# EasyEDA schematic SCH_Tremolo schematic_2023-01-16.json
TITLE: Tremolo; REV: 1.0; Date: 2022-03-30; Sheet: 1/1; Drawn By: Leevi & Eemeli
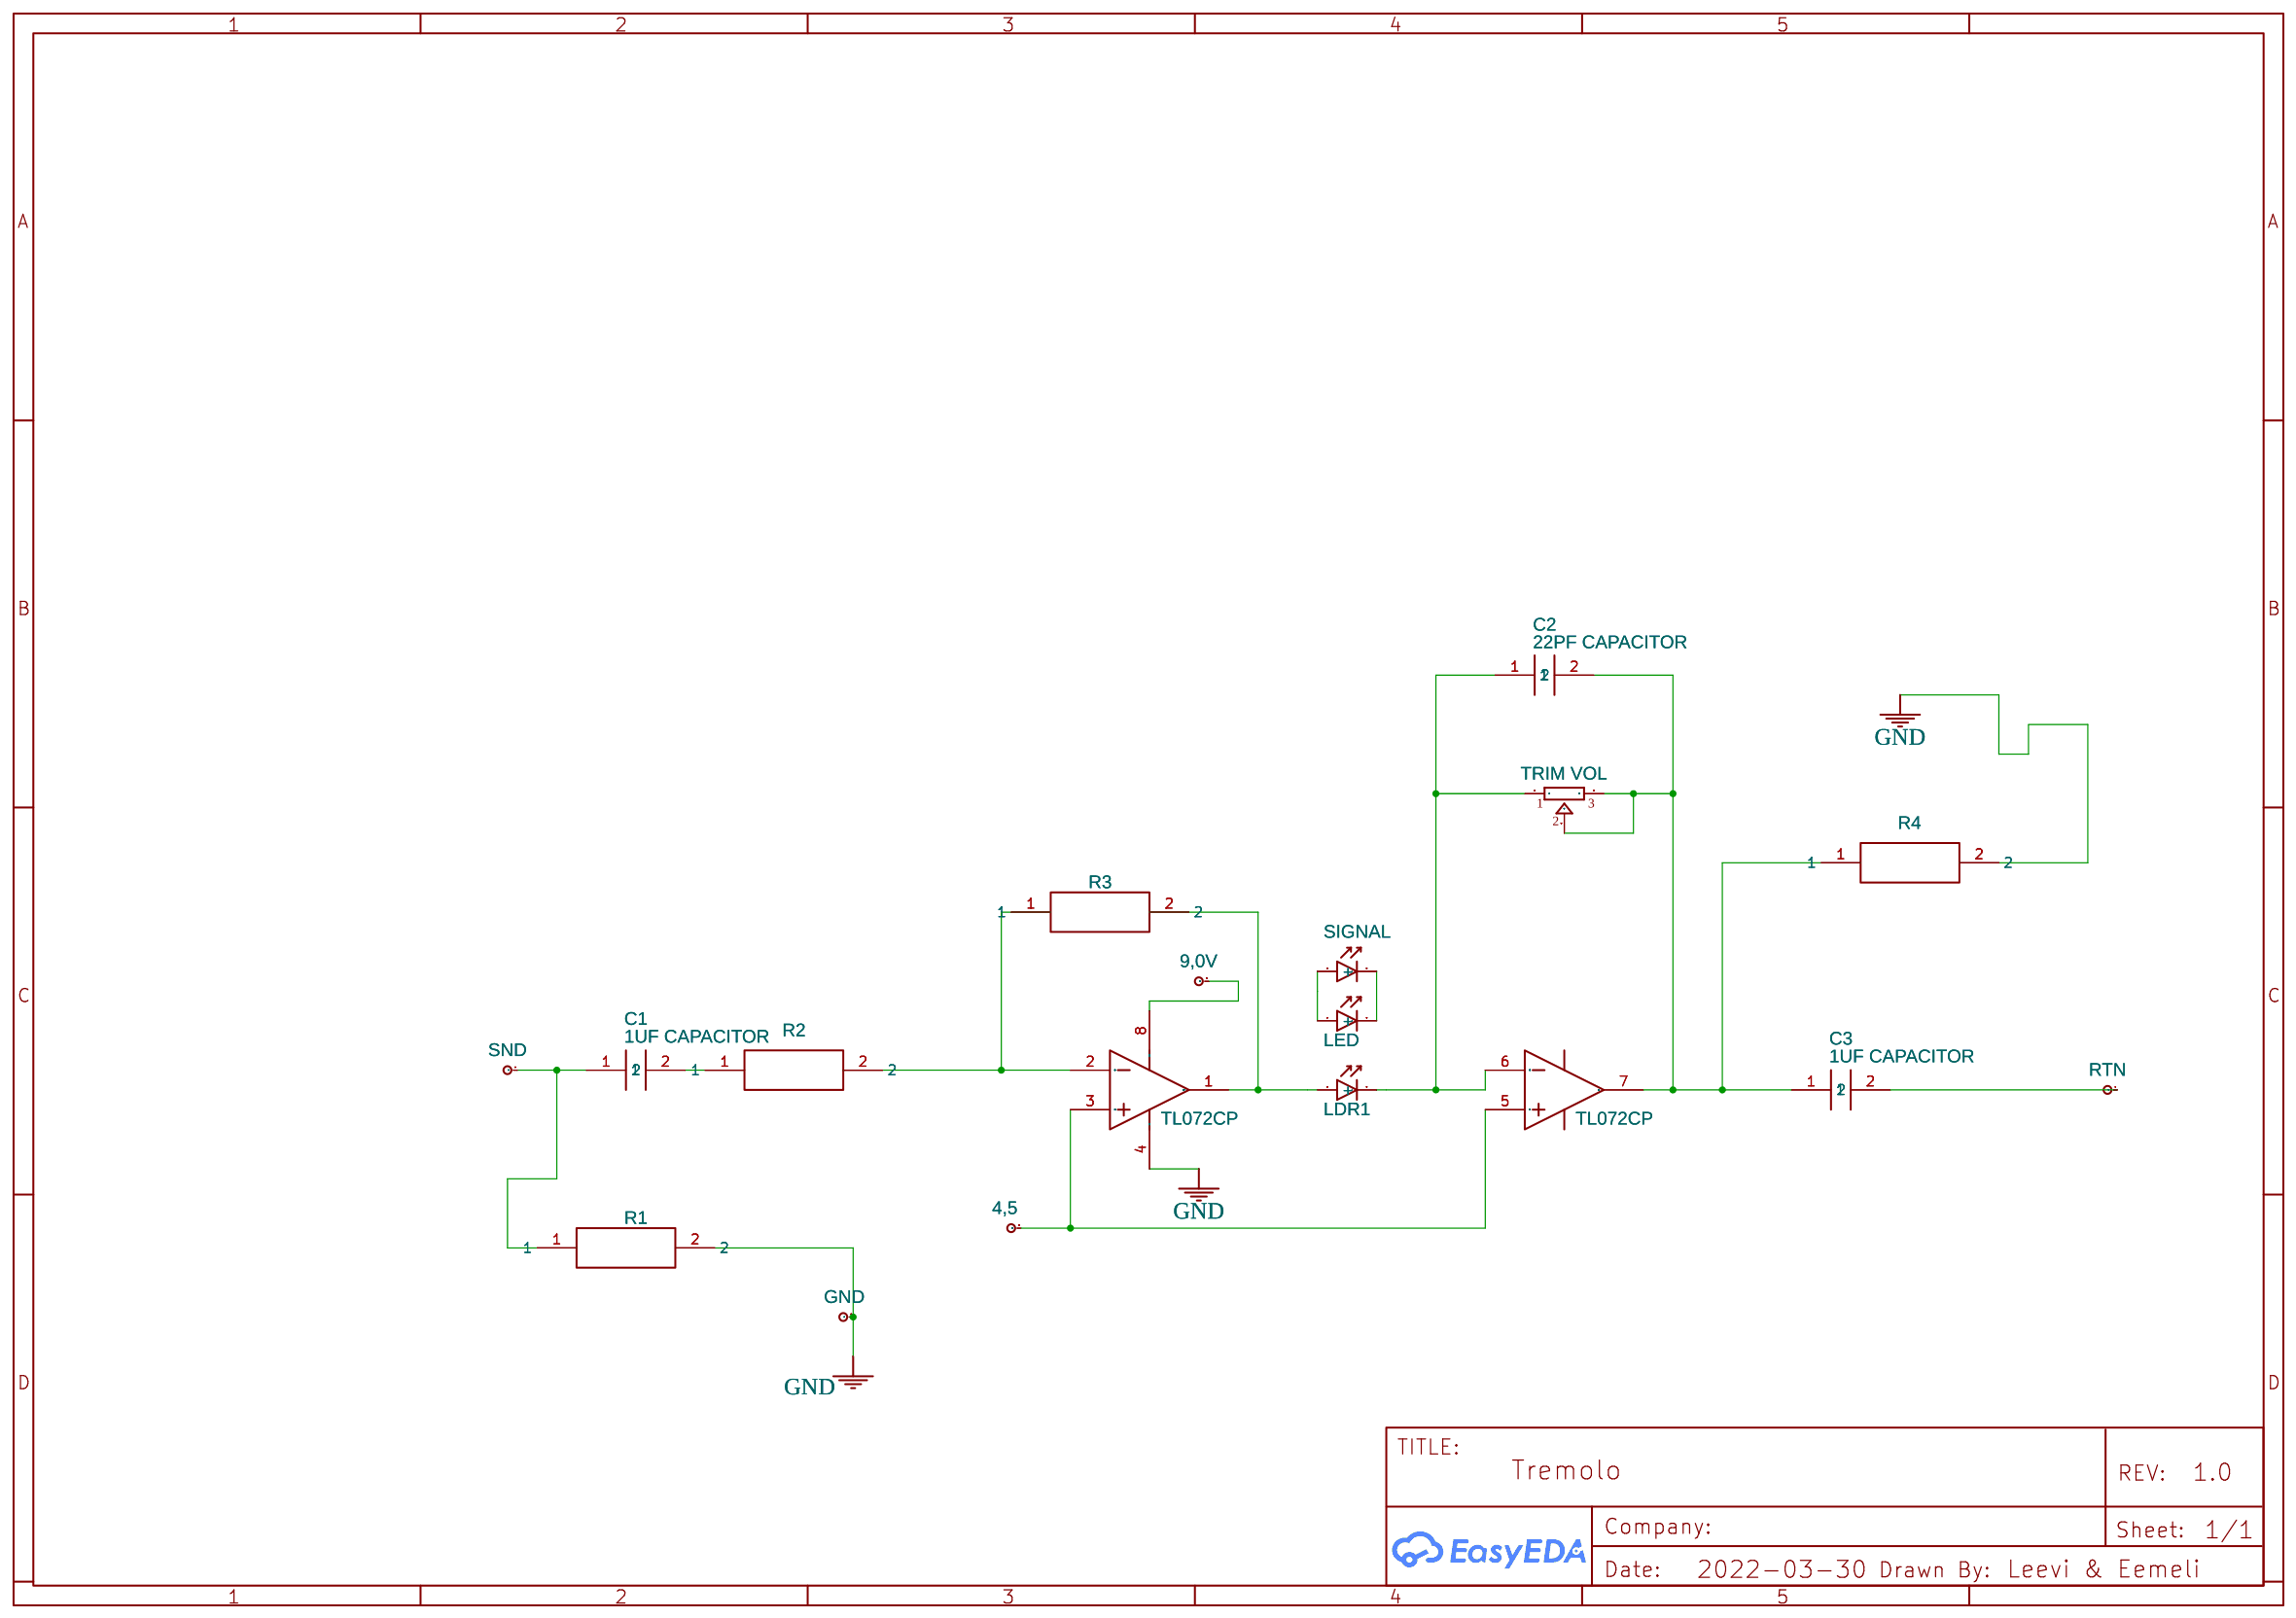
[diagram p0: schematic sheet]

## Parts
4,5  4,5V  [PINPAD]
9,0V  PINPAD  [PINPAD]
C1  1UF CAPACITOR  [1UF CAPACITOR]
C2  22PF CAPACITOR  [22PF CAPACITAOR]
C3  1UF CAPACITOR  [1UF CAPACITOR]
GND  PINPAD  [PINPAD]
LDR1  LED - THROUGH HOLE 3MM  [LED-3MM-2.54MM-THROUGH HOLE]
LED  LED - THROUGH HOLE 3MM  [LED-3MM-2.54MM-THROUGH HOLE]
R1  GENERIC THROUGH-HOLE RESISTOR  [GENERIC THROUGH-HOLE RESISTOR]
R2  GENERIC THROUGH-HOLE RESISTOR  [GENERIC THROUGH-HOLE RESISTOR]
R3  GENERIC THROUGH-HOLE RESISTOR  [GENERIC THROUGH-HOLE RESISTOR]
R4  GENERIC THROUGH-HOLE RESISTOR  [GENERIC THROUGH-HOLE RESISTOR]
RTN  PINPAD  [PINPAD]
SIGNAL  LED - THROUGH HOLE 3MM  [LED-3MM-2.54MM-THROUGH HOLE]
SND  PINPAD  [PINPAD]
U1  TL072CP  [DIP-8_L9.6-W6.4-P2.54-LS7.6-BL-1]  (sections 1,2)
VOL  TRIM VOL  [100K TRIM]

## Library data of the parts
4,5 9,0V GND RTN SND = PINPAD: Contributor: Frank67
C1 C3 = 1UF CAPACITOR: Contributor: lettu555
C2 = 22PF CAPACITOR: Contributor: lettu555
LDR1 LED SIGNAL = LED - THROUGH HOLE 3MM: Supplier: Mouser; Contributor: EctoLabs
R1-R4 = GENERIC THROUGH-HOLE RESISTOR: Contributor: 18ee139
U1 = TL072CP: tags: FET Operational Amplifier; Supplier Part: C7236; Supplier: LCSC; Manufacturer: TI; subpart_no: 1; JLCPCB Part Class: Extended Part
VOL = TRIMMER: Contributor: DangerousPrototype

## Nets
GND: GND.1 R1.2 R4.2 U1.4(VCC-)
Net-(4,5-1): 4,5.1 U1.3(IN1+) U1.5(IN2+)
Net-(9,0V-1): 9,0V.1 U1.8(VCC+)
Net-(C1-1): C1.1 R1.1 SND.1
Net-(C1-2): C1.2 R2.1
Net-(C2-1): C2.1 LDR1.2(-) U1.6(IN2-) VOL.1
Net-(C2-2): C2.2 C3.1 R4.1 U1.7(OUT2) VOL.2 VOL.3
Net-(C3-2): C3.2 RTN.1
Net-(LDR1-1): LDR1.1(+) R3.2 U1.1(OUT1)
Net-(LED-1): LED.1(+) SIGNAL.1(+)
Net-(LED-2): LED.2(-) SIGNAL.2(-)
Net-(R2-2): R2.2 R3.1 U1.2(IN1-)
